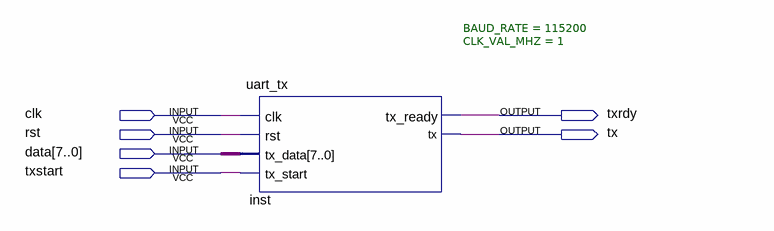
[diagram p0: schematic sheet]
// Quartus schematic uart_tx_test.bdf as structural Verilog: 1 symbols, 6 pins
module uart_tx_test (
  input  clk,
  input  rst,
  input  [7:0] data,
  input  txstart,
  output txrdy,
  output tx
);

  uart_tx #(.BAUD_RATE(115200), .CLK_VAL_MHZ(1)) inst (
    .clk(clk), .rst(rst), .tx_data(data), .tx_start(txstart), .tx_ready(txrdy), .tx(tx));
endmodule
